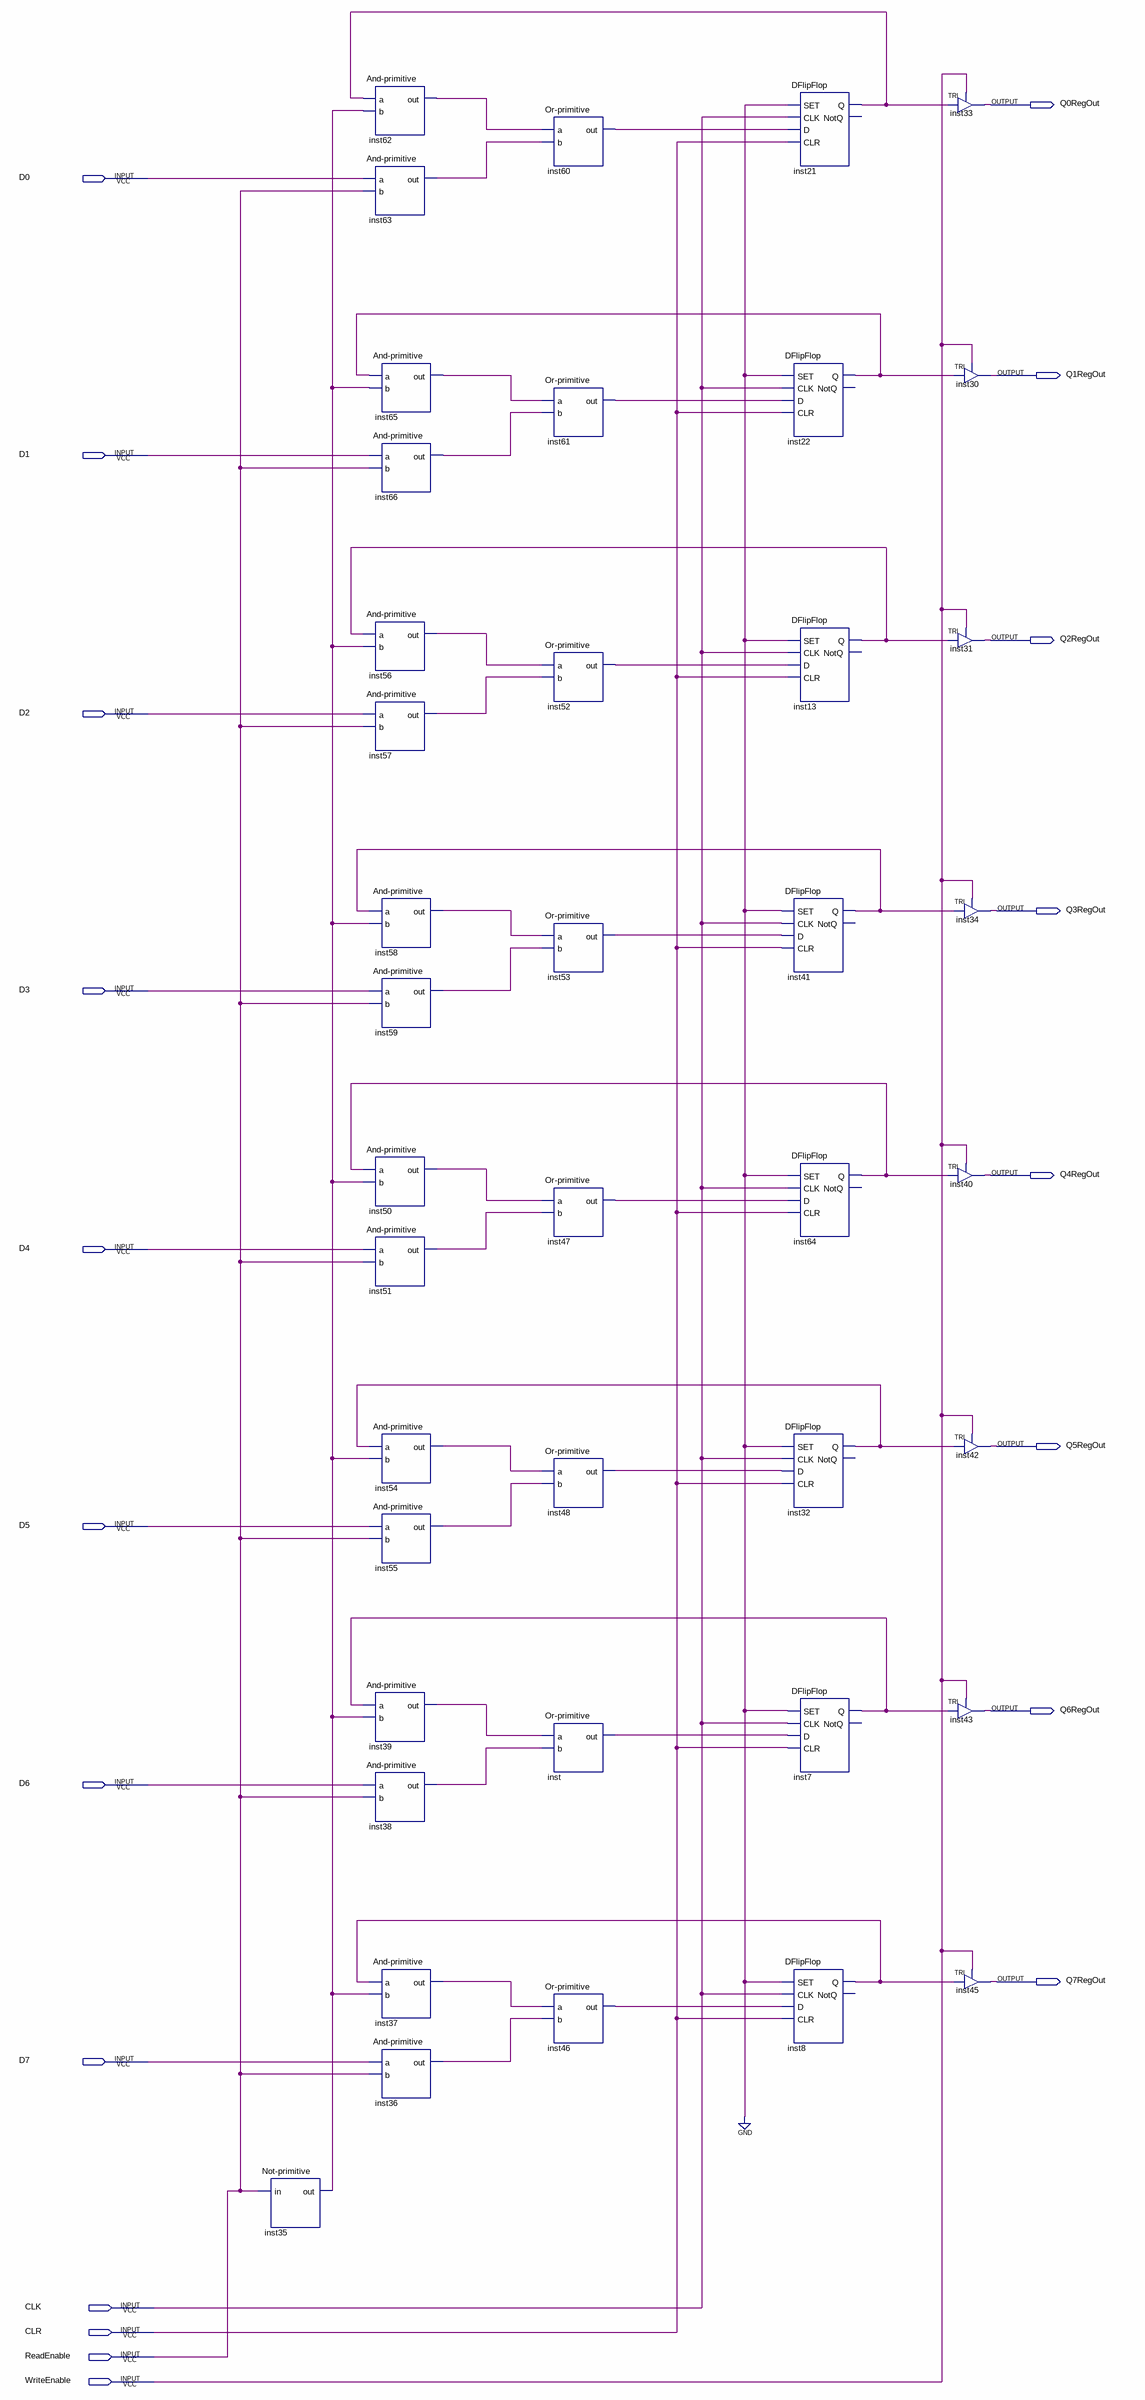
[diagram p0: schematic sheet]
// Quartus schematic 8-Bit-Register.bdf as structural Verilog: 41 symbols, 20 pins
module \8-Bit-Register  (
  input  D0,
  input  D1,
  input  D2,
  input  D3,
  input  D4,
  input  D5,
  input  D6,
  input  D7,
  input  CLK,
  input  CLR,
  input  ReadEnable,
  input  WriteEnable,
  output Q0RegOut,
  output Q1RegOut,
  output Q2RegOut,
  output Q3RegOut,
  output Q4RegOut,
  output Q5RegOut,
  output Q6RegOut,
  output Q7RegOut
);

  wire inst7_q, inst8_q, inst13_q, inst21_q, inst22_q, inst32_q, inst35_out, inst36_out, inst37_out,
       inst38_out, inst39_out, inst41_q, inst46_out, inst47_out, inst48_out, inst50_out, inst51_out,
       inst52_out, inst53_out, inst54_out, inst55_out, inst56_out, inst57_out, inst58_out, inst59_out,
       inst60_out, inst61_out, inst62_out, inst63_out, inst64_q, inst65_out, inst66_out, inst_out;

  \Not-primitive  inst35 (.in(ReadEnable), .out(inst35_out));
  \And-primitive  inst62 (.a(inst21_q), .b(inst35_out), .out(inst62_out));
  \And-primitive  inst63 (.a(D0), .b(ReadEnable), .out(inst63_out));
  \And-primitive  inst65 (.a(inst22_q), .b(inst35_out), .out(inst65_out));
  \And-primitive  inst66 (.a(D1), .b(ReadEnable), .out(inst66_out));
  \And-primitive  inst56 (.a(inst13_q), .b(inst35_out), .out(inst56_out));
  \And-primitive  inst57 (.a(D2), .b(ReadEnable), .out(inst57_out));
  \And-primitive  inst58 (.a(inst41_q), .b(inst35_out), .out(inst58_out));
  \And-primitive  inst59 (.a(D3), .b(ReadEnable), .out(inst59_out));
  \And-primitive  inst50 (.a(inst64_q), .b(inst35_out), .out(inst50_out));
  \And-primitive  inst51 (.a(D4), .b(ReadEnable), .out(inst51_out));
  \And-primitive  inst54 (.a(inst32_q), .b(inst35_out), .out(inst54_out));
  \And-primitive  inst55 (.a(D5), .b(ReadEnable), .out(inst55_out));
  \And-primitive  inst39 (.a(inst7_q), .b(inst35_out), .out(inst39_out));
  \And-primitive  inst38 (.a(D6), .b(ReadEnable), .out(inst38_out));
  \And-primitive  inst37 (.a(inst8_q), .b(inst35_out), .out(inst37_out));
  \And-primitive  inst36 (.a(D7), .b(ReadEnable), .out(inst36_out));
  \Or-primitive  inst60 (.a(inst62_out), .b(inst63_out), .out(inst60_out));
  \Or-primitive  inst61 (.a(inst65_out), .b(inst66_out), .out(inst61_out));
  \Or-primitive  inst52 (.a(inst56_out), .b(inst57_out), .out(inst52_out));
  \Or-primitive  inst53 (.a(inst58_out), .b(inst59_out), .out(inst53_out));
  \Or-primitive  inst47 (.a(inst50_out), .b(inst51_out), .out(inst47_out));
  \Or-primitive  inst48 (.a(inst54_out), .b(inst55_out), .out(inst48_out));
  \Or-primitive  inst (.a(inst39_out), .b(inst38_out), .out(inst_out));
  \Or-primitive  inst46 (.a(inst37_out), .b(inst36_out), .out(inst46_out));
  DFlipFlop inst21 (.SET(1'b0), .CLK(CLK), .D(inst60_out), .CLR(CLR), .Q(inst21_q));  // open: NotQ
  DFlipFlop inst22 (.SET(1'b0), .CLK(CLK), .D(inst61_out), .CLR(CLR), .Q(inst22_q));  // open: NotQ
  DFlipFlop inst13 (.SET(1'b0), .CLK(CLK), .D(inst52_out), .CLR(CLR), .Q(inst13_q));  // open: NotQ
  DFlipFlop inst41 (.SET(1'b0), .CLK(CLK), .D(inst53_out), .CLR(CLR), .Q(inst41_q));  // open: NotQ
  DFlipFlop inst64 (.SET(1'b0), .CLK(CLK), .D(inst47_out), .CLR(CLR), .Q(inst64_q));  // open: NotQ
  DFlipFlop inst32 (.SET(1'b0), .CLK(CLK), .D(inst48_out), .CLR(CLR), .Q(inst32_q));  // open: NotQ
  DFlipFlop inst7 (.SET(1'b0), .CLK(CLK), .D(inst_out), .CLR(CLR), .Q(inst7_q));  // open: NotQ
  DFlipFlop inst8 (.SET(1'b0), .CLK(CLK), .D(inst46_out), .CLR(CLR), .Q(inst8_q));  // open: NotQ
  TRI inst33 (.IN(inst21_q), .OE(WriteEnable), .OUT(Q0RegOut));
  TRI inst30 (.IN(inst22_q), .OE(WriteEnable), .OUT(Q1RegOut));
  TRI inst31 (.IN(inst13_q), .OE(WriteEnable), .OUT(Q2RegOut));
  TRI inst34 (.IN(inst41_q), .OE(WriteEnable), .OUT(Q3RegOut));
  TRI inst40 (.IN(inst64_q), .OE(WriteEnable), .OUT(Q4RegOut));
  TRI inst42 (.IN(inst32_q), .OE(WriteEnable), .OUT(Q5RegOut));
  TRI inst43 (.IN(inst7_q), .OE(WriteEnable), .OUT(Q6RegOut));
  TRI inst45 (.IN(inst8_q), .OE(WriteEnable), .OUT(Q7RegOut));
endmodule
